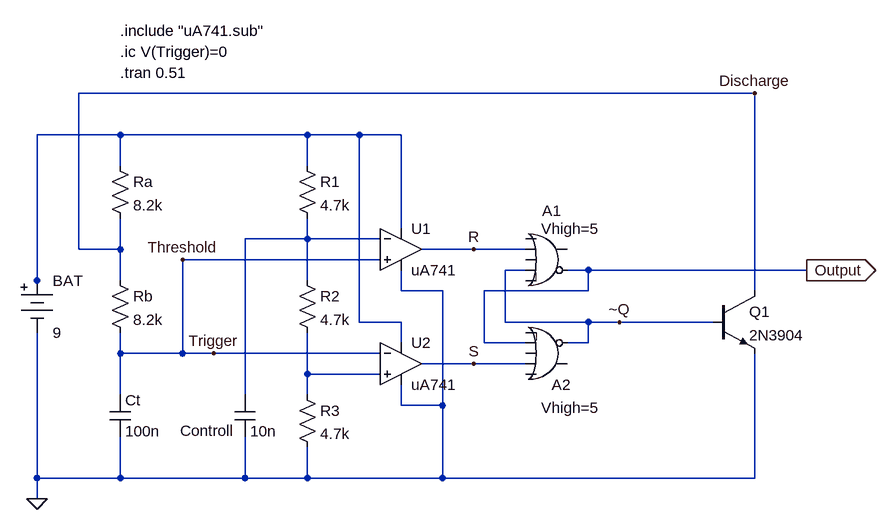
[diagram p0: schematic 555_Oscillator.asc]
555_Oscillator.asc, the LTspice schematic file:
Version 4
SHEET 1 1620 816
WIRE 720 -64 -320 -64
WIRE -256 0 -384 0
WIRE 32 0 -256 0
WIRE 112 0 32 0
WIRE 176 0 112 0
WIRE -256 48 -256 0
WIRE 32 48 32 0
WIRE 176 144 176 0
WIRE 32 160 32 128
WIRE 32 160 -64 160
WIRE 144 160 32 160
WIRE -320 176 -320 -64
WIRE -256 176 -256 128
WIRE -256 176 -320 176
WIRE 288 176 208 176
WIRE 368 176 288 176
WIRE 144 192 -160 192
WIRE 368 208 336 208
WIRE 464 208 432 208
WIRE 800 208 464 208
WIRE -384 224 -384 0
WIRE -256 224 -256 176
WIRE 32 224 32 160
WIRE -384 240 -384 224
WIRE 176 240 176 208
WIRE 240 240 176 240
WIRE 464 240 464 208
WIRE 464 240 304 240
WIRE 720 240 720 -64
WIRE 112 288 112 0
WIRE 176 288 112 288
WIRE 336 288 336 208
WIRE 464 288 336 288
WIRE 512 288 464 288
WIRE 656 288 512 288
WIRE 176 320 176 288
WIRE 304 320 304 240
WIRE 368 320 304 320
WIRE 464 320 464 288
WIRE 464 320 432 320
WIRE -256 336 -256 304
WIRE -160 336 -160 192
WIRE -160 336 -256 336
WIRE -112 336 -160 336
WIRE 144 336 -112 336
WIRE 288 352 208 352
WIRE 368 352 288 352
WIRE 32 368 32 304
WIRE 144 368 32 368
WIRE -256 400 -256 336
WIRE -64 400 -64 160
WIRE 32 400 32 368
WIRE 176 416 176 384
WIRE 240 416 240 240
WIRE 240 416 176 416
WIRE -384 528 -384 304
WIRE -256 528 -256 464
WIRE -256 528 -384 528
WIRE -64 528 -64 464
WIRE -64 528 -256 528
WIRE 32 528 32 480
WIRE 32 528 -64 528
WIRE 240 528 240 416
WIRE 240 528 32 528
WIRE 720 528 720 336
WIRE 720 528 240 528
WIRE -384 560 -384 528
FLAG -384 560 0
FLAG -160 192 Threshold
FLAG 288 176 R
FLAG 288 352 S
FLAG 720 -64 Discharge
FLAG -112 336 Trigger
FLAG 512 288 ~Q
FLAG 800 208 Output
IOPIN 800 208 Out
SYMBOL res 16 32 R0
SYMATTR InstName R1
SYMATTR Value 4.7k
SYMBOL res 16 208 R0
SYMATTR InstName R2
SYMATTR Value 4.7k
SYMBOL res 16 384 R0
SYMATTR InstName R3
SYMATTR Value 4.7k
SYMBOL res -272 32 R0
SYMATTR InstName Ra
SYMATTR Value 8.2k
SYMBOL res -272 208 R0
SYMATTR InstName Rb
SYMATTR Value 8.2k
SYMBOL Misc\\battery -384 208 R0
SYMATTR InstName BAT
SYMATTR Value 9
SYMBOL cap -80 400 R0
WINDOW 0 -84 55 Left 2
SYMATTR InstName Controll
SYMATTR Value 10n
SYMBOL npn 656 240 R0
SYMATTR InstName Q1
SYMATTR Value 2N3904
SYMBOL Digital\\or 400 128 R0
WINDOW 3 -8 16 Left 2
WINDOW 0 -7 -11 Left 2
SYMATTR Value Vhigh=5
SYMATTR InstName A1
SYMBOL Digital\\or 400 400 M180
WINDOW 3 -8 -20 Left 2
SYMATTR Value Vhigh=5
SYMATTR InstName A2
SYMBOL cap -272 400 R0
SYMATTR InstName Ct
SYMATTR Value 100n
SYMBOL OpAmps\\opamp2 176 112 R0
SYMATTR InstName U1
SYMATTR Value uA741
SYMBOL OpAmps\\opamp2 176 288 R0
SYMATTR InstName U2
SYMATTR Value uA741
TEXT -256 -96 Left 2 !.tran 0.51
TEXT -256 -128 Left 2 !.ic V(Trigger)=0
TEXT -256 -160 Left 2 !.include "uA741.sub"

The netlist it stands for:
* 555_Oscillator.asc
R1 N001 N002 4.7k
R2 N002 N003 4.7k
R3 N003 0 4.7k
Ra N001 Discharge 8.2k
Rb Discharge Trigger 8.2k
V§BAT N001 0 9
Controll N002 0 10n
Q1 Discharge ~Q 0 0 2N3904
A1 0 R 0 ~Q 0 Output 0 0 OR Vhigh=5
A2 0 S 0 Output 0 ~Q 0 0 OR Vhigh=5
Ct Trigger 0 100n
XU1 Trigger N002 N001 0 R uA741  ; pins In+ In- V+ V- OUT
XU2 N003 Trigger N001 0 S uA741  ; pins In+ In- V+ V- OUT
.model NPN NPN
.model PNP PNP
.lib standard.bjt
.tran 0.51
.ic V(Trigger)=0
.include "uA741.sub"
.backanno
.end